# EAGLE design lixie_digit (EAGLE 7.6.0)
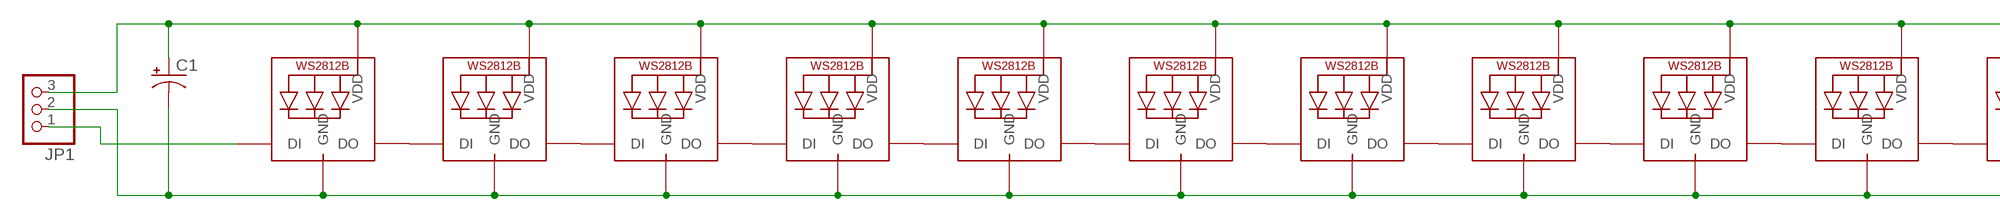
[diagram p0: schematic, sheet 1, part 1 of 2]
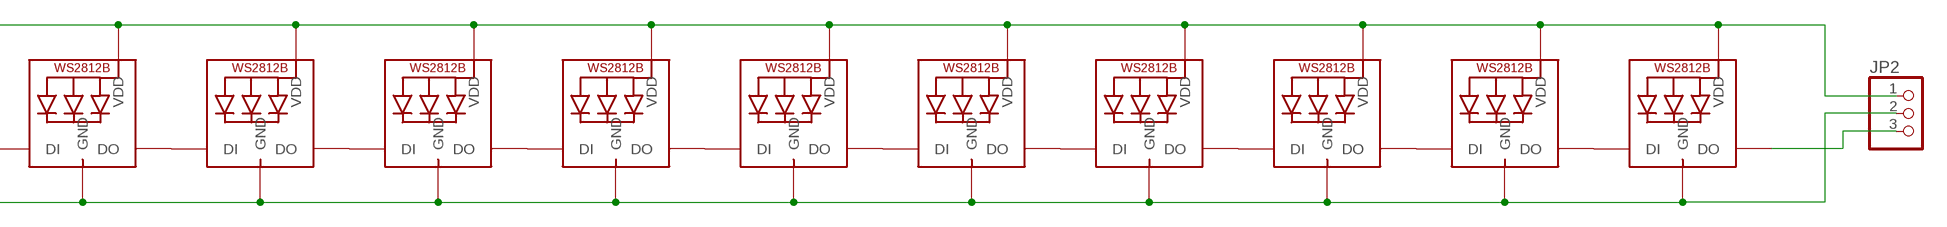
[diagram p1: schematic, sheet 1, part 2 of 2]

## Parts
C1  CPOL-USE3.5-8  [E3,5-8]
JP1  PINHD-1X3  [1X03]
JP2  PINHD-1X3  [1X03]
LED1  WS2812B5050  [WS2812B]
LED2  WS2812B5050  [WS2812B]
LED3  WS2812B5050  [WS2812B]
LED4  WS2812B5050  [WS2812B]
LED5  WS2812B5050  [WS2812B]
LED6  WS2812B5050  [WS2812B]
LED7  WS2812B5050  [WS2812B]
LED8  WS2812B5050  [WS2812B]
LED9  WS2812B5050  [WS2812B]
LED10  WS2812B5050  [WS2812B]
LED11  WS2812B5050  [WS2812B]
LED12  WS2812B5050  [WS2812B]
LED13  WS2812B5050  [WS2812B]
LED14  WS2812B5050  [WS2812B]
LED15  WS2812B5050  [WS2812B]
LED16  WS2812B5050  [WS2812B]
LED17  WS2812B5050  [WS2812B]
LED18  WS2812B5050  [WS2812B]
LED19  WS2812B5050  [WS2812B]
LED20  WS2812B5050  [WS2812B]

## Nets
GND: C1.- JP1.2 JP2.2 LED1.3-GND(GND) LED2.3-GND(GND) LED3.3-GND(GND) LED4.3-GND(GND) LED5.3-GND(GND) LED6.3-GND(GND) LED7.3-GND(GND) LED8.3-GND(GND) LED9.3-GND(GND) LED10.3-GND(GND) LED11.3-GND(GND) LED12.3-GND(GND) LED13.3-GND(GND) LED14.3-GND(GND) LED15.3-GND(GND) LED16.3-GND(GND) LED17.3-GND(GND) LED18.3-GND(GND) LED19.3-GND(GND) LED20.3-GND(GND)
N$1: LED1.2-DOUT(DO) LED2.4-DIN(DI)
N$2: LED2.2-DOUT(DO) LED3.4-DIN(DI)
N$3: LED3.2-DOUT(DO) LED4.4-DIN(DI)
N$4: LED4.2-DOUT(DO) LED5.4-DIN(DI)
N$5: LED5.2-DOUT(DO) LED6.4-DIN(DI)
N$6: LED6.2-DOUT(DO) LED7.4-DIN(DI)
N$7: LED7.2-DOUT(DO) LED8.4-DIN(DI)
N$8: LED8.2-DOUT(DO) LED9.4-DIN(DI)
N$9: LED9.2-DOUT(DO) LED10.4-DIN(DI)
N$10: LED10.2-DOUT(DO) LED11.4-DIN(DI)
N$11: LED11.2-DOUT(DO) LED12.4-DIN(DI)
N$12: LED12.2-DOUT(DO) LED13.4-DIN(DI)
N$13: LED13.2-DOUT(DO) LED14.4-DIN(DI)
N$14: LED14.2-DOUT(DO) LED15.4-DIN(DI)
N$15: LED15.2-DOUT(DO) LED16.4-DIN(DI)
N$16: LED16.2-DOUT(DO) LED17.4-DIN(DI)
N$17: LED17.2-DOUT(DO) LED18.4-DIN(DI)
N$18: LED18.2-DOUT(DO) LED19.4-DIN(DI)
N$19: LED19.2-DOUT(DO) LED20.4-DIN(DI)
N$20: C1.+ JP1.3 JP2.1 LED1.1-VDD(VDD) LED2.1-VDD(VDD) LED3.1-VDD(VDD) LED4.1-VDD(VDD) LED5.1-VDD(VDD) LED6.1-VDD(VDD) LED7.1-VDD(VDD) LED8.1-VDD(VDD) LED9.1-VDD(VDD) LED10.1-VDD(VDD) LED11.1-VDD(VDD) LED12.1-VDD(VDD) LED13.1-VDD(VDD) LED14.1-VDD(VDD) LED15.1-VDD(VDD) LED16.1-VDD(VDD) LED17.1-VDD(VDD) LED18.1-VDD(VDD) LED19.1-VDD(VDD) LED20.1-VDD(VDD)
N$23: JP1.1 LED1.4-DIN(DI)
N$24: JP2.3 LED20.2-DOUT(DO)

## Library data of the parts
C1 = adafruit:CPOL-US: POLARIZED CAPACITOR, American symbol
JP1 JP2 = adafruit:PINHD-1X3: PIN HEADER
LED1-LED20 = adafruit:WS2812B

## Board
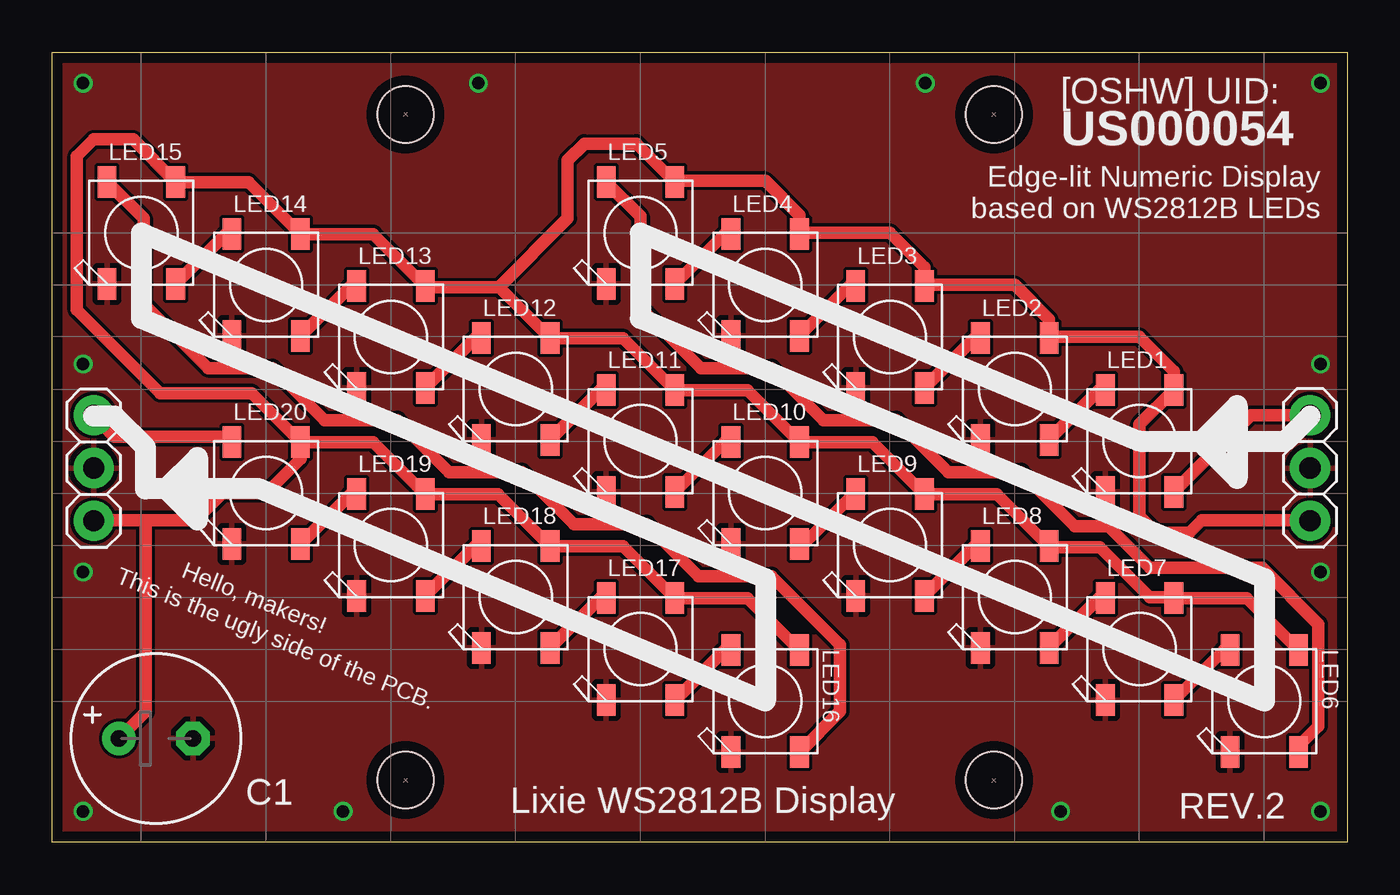
[diagram p2: board, top side]
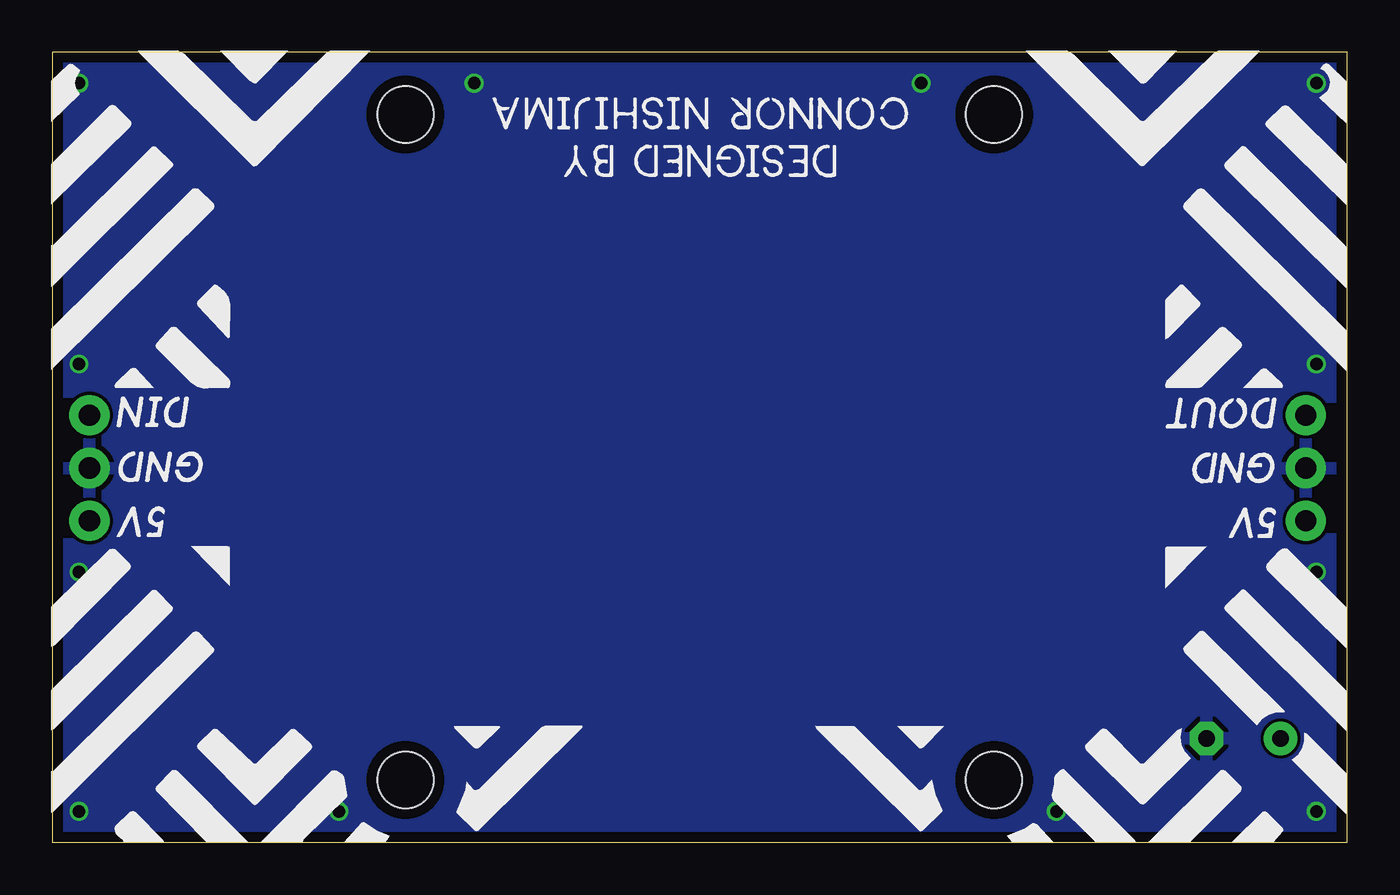
[diagram p3: board, bottom side, seen from below]

Size 62.3 x 38 mm. Coordinates in mm from the lower left corner, seen from the top.
Outline: 0,0 0,38 62.3,38 62.3,0 0,0
Copper layers (1*16): Top 0.035mm / dielectric 1.6mm / Bottom 0.035mm
Design rules "Elecrow_2-layer_PCB_eagle_rule": minimum track width 6mil, minimum drill 12mil, track to track 6mil, track to pad 6mil, pad to pad 6mil, via to via 8mil, smd to smd 0mil, copper to edge 20mil, drill to drill 10mil, minimum pad ring 6mil, minimum via ring 6mil, stop-mask expansion 0mil, vias tented up to drill 100mil, thermal gap 10mil
Holes 2.7 mm at 17,35 45.3,35 45.3,3 17,3

### Footprints (pad centres in the part's own frame; a part is rotated, then mirrored left to right if it is on the bottom)
E3,5-8 = drill 0.813 pad 1.6: + -1.778,0 | drill 0.813 pad 1.6 octagon: - 1.778,0
1X03 = drill 1.016 pad 1.93: 1 -2.54,0; 2 0,0; 3 2.54,0
WS2812B = smd 1.5 x 0.9: 1-VDD 2.45,-1.65; 2-DOUT 2.45,1.65; 3-GND -2.45,1.65; 4-DIN -2.45,-1.65

### Placement (x,y rotation side)
C1  5,5 0 top
JP1  60.5,18 270 top
JP2  2,18 90 top
LED1  52.3,19.3 90 top
LED2  46.3,21.8 90 top
LED3  40.3,24.3 90 top
LED4  34.3,26.8 90 top
LED5  28.3,29.3 90 top
LED6  58.3,6.8 90 top
LED7  52.3,9.3 90 top
LED8  46.3,11.8 90 top
LED9  40.3,14.3 90 top
LED10  34.3,16.8 90 top
LED11  28.3,19.3 90 top
LED12  22.3,21.8 90 top
LED13  16.3,24.3 90 top
LED14  10.3,26.8 90 top
LED15  4.3,29.3 90 top
LED16  34.3,6.8 90 top
LED17  28.3,9.3 90 top
LED18  22.3,11.8 90 top
LED19  16.3,14.3 90 top
LED20  10.3,16.8 90 top

### Tracks (layer width: path | path; a pad name or v marks a point on that pad's centre or on a via)
GND  (via drill 0.6)
  other vias: 1.5,36.5 61,36.5 61,1.5 1.5,1.5 1.5,23 1.5,13 61,23 61,13 20.5,36.5 42,36.5 14,1.5 48.5,1.5
  pour Top: 63,-1 -1,-1 -1,39 63,39
  pour Bottom: -1.5,39.5 63.5,39.5 63.5,-1.5 -1.5,-1.5
N$1
  Top 0.61: LED1.2-DOUT 50.35,21.75 LED2.4-DIN
N$2
  Top 0.61: LED2.2-DOUT 44.35,24.25 LED3.4-DIN
N$3
  Top 0.61: LED3.2-DOUT 38.6,26.8 38.4,26.8 LED4.4-DIN
N$4
  Top 0.61: LED4.2-DOUT 32.35,29.25 LED5.4-DIN
N$5
  Top 0.61: LED5.2-DOUT 28.3,30.1 28.3,25.7 31.2,22.8 34.6,22.8 37.1,20.3 40.6,20.3 43.1,17.8 46.6,17.8 49.2,15.2 50.8,15.2 52.8,13.2 58.2,13.2 60.9,10.5 60.9,5.6 59.95,4.65 LED6.4-DIN
N$6
  Top 0.61: LED7.4-DIN 56.35,9.25 LED6.2-DOUT
N$7
  Top 0.61: LED8.4-DIN 50.35,11.75 LED7.2-DOUT
N$8
  Top 0.61: LED9.4-DIN 44.35,14.25 LED8.2-DOUT
N$9
  Top 0.61: LED10.4-DIN 36,14.3 36,14.2 38.55,16.75 LED9.2-DOUT
N$10
  Top 0.61: LED11.4-DIN 32.35,19.25 LED10.2-DOUT
N$11
  Top 0.61: LED12.4-DIN 26.35,21.75 LED11.2-DOUT
N$12
  Top 0.61: LED13.4-DIN 20.35,24.25 LED12.2-DOUT
N$13
  Top 0.61: LED14.4-DIN 14.35,26.75 LED13.2-DOUT
N$14
  Top 0.61: LED15.4-DIN 8.35,29.25 LED14.2-DOUT
N$15
  Top 0.61: LED15.2-DOUT 4.4,30 4.4,25.9 7.5,22.8 10.6,22.8 13.1,20.3 16.6,20.3 19.1,17.8 22.6,17.8 25.1,15.3 28.6,15.3 31.1,12.8 34.6,12.8 37.9,9.5 37.9,6.3 LED16.4-DIN
N$16
  Top 0.61: LED17.4-DIN 32.35,9.25 LED16.2-DOUT
N$17
  Top 0.61: LED18.4-DIN 26.35,11.75 LED17.2-DOUT
N$18
  Top 0.61: LED19.4-DIN 20.35,14.25 LED18.2-DOUT
N$19
  Top 0.61: LED20.4-DIN 14.35,16.75 LED19.2-DOUT
N$20
  Top 0.61: LED6.1-VDD 57.45,11.75 LED7.1-VDD 53.8,11.8 52.8,11.8 50.4,14.2 48,14.2 LED8.1-VDD 45.45,16.75 LED9.1-VDD 39.45,19.25 LED10.1-VDD 33.45,21.75 LED11.1-VDD 27.45,24.25 LED12.1-VDD 21.5,26.7 | 12.05,19.25 LED20.1-VDD 11.95,18.45 10.3,16.8 8.2,16.8 6.9,15.5 4.5,15.5 | LED16.1-VDD 33.45,11.75 LED17.1-VDD 27.45,14.25 LED18.1-VDD 21.45,16.75 LED19.1-VDD 15.45,19.25 12.05,19.25 | 21.5,26.7 18,26.7 LED13.1-VDD 15.45,29.25 LED14.1-VDD 9.45,31.75 LED15.1-VDD 3.9,33.8 2,33.8 1.2,33 1.2,25.6 5.2,21.6 9.6,21.6 11.9,19.3 12,19.3 12.05,19.25 | 4.5,15.5 2.04,15.5 JP2.1 | 21.5,26.7 24.8,30 24.8,32.8 25.6,33.6 28.1,33.6 LED5.1-VDD 30,31.8 34.3,31.8 35.95,30.15 LED4.1-VDD 36,29.3 40.3,29.3 41.95,27.65 LED3.1-VDD 42,26.8 46.3,26.8 47.95,25.15 LED2.1-VDD 48,24.3 52.3,24.3 53.95,22.65 LED1.1-VDD 52.3,20.1 52.3,15.7 53.1,14.9 54.7,14.9 55.3,15.5 60.5,15.5 JP1.3 | C1.+ 4.5,6.28 4.5,15.5
N$23
  Top 0.61: JP1.1 57.64,20.54 LED1.4-DIN
N$24
  Top 0.61: JP2.3 3,19.5 8.5,19.5 8.6,19.6 8.7,19.3 LED20.2-DOUT

### Text on the board
tPlace: [OSHW] UID: | US000054 | Edge-lit Numeric Display / based on WS2812B LEDs | This is the ugly side of the PCB. | Hello, makers!
tNames: REV.2 | Lixie WS2812B Display
tDocu: Lixie Display PCB | Revision 2 | Layout by Connor Nishijima | Last Updated: / December 16th, 2016 | Released under the GPLv3 License | [OSHW] US000054